# EAGLE design module_duino (EAGLE 7.1.0)
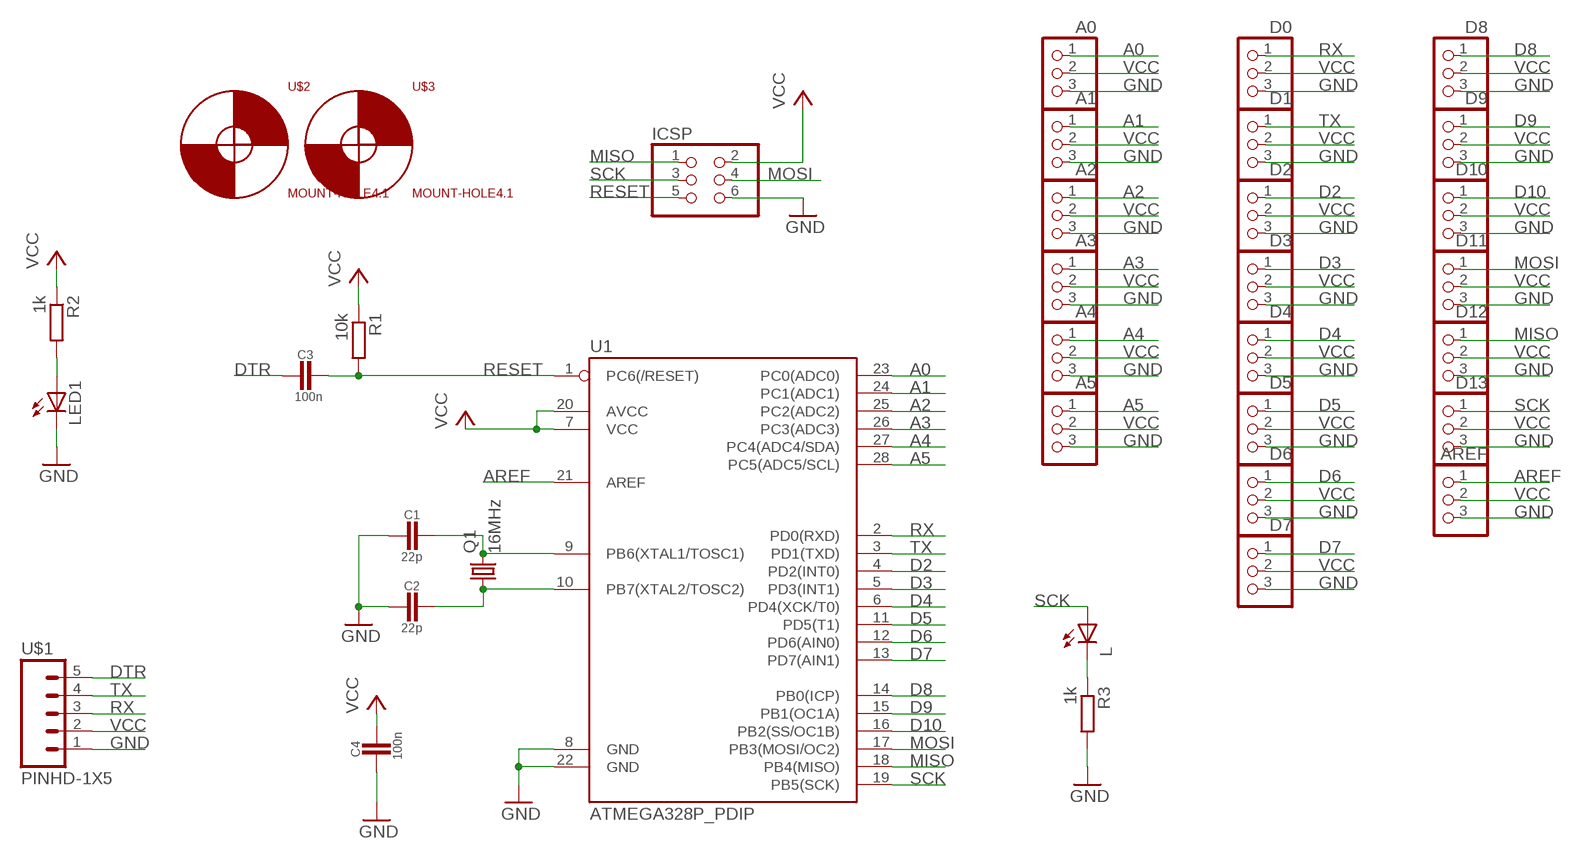
[diagram p0: schematic, sheet 1]

## Parts
A0  PINHD-1X3  [1X03]
A1  PINHD-1X3  [1X03]
A2  PINHD-1X3  [1X03]
A3  PINHD-1X3  [1X03]
A4  PINHD-1X3  [1X03]
A5  PINHD-1X3  [1X03]
AREF  PINHD-1X3  [1X03]
C1  22p  CAP  [CAP-PTH-5MM]
C2  22p  CAP  [CAP-PTH-5MM]
C3  100n  CAP  [CAP-PTH-5MM]
C4  100n  CAP  [CAP-PTH-5MM]
D0  PINHD-1X3  [1X03]
D1  PINHD-1X3  [1X03]
D2  PINHD-1X3  [1X03]
D3  PINHD-1X3  [1X03]
D4  PINHD-1X3  [1X03]
D5  PINHD-1X3  [1X03]
D6  PINHD-1X3  [1X03]
D7  PINHD-1X3  [1X03]
D8  PINHD-1X3  [1X03]
D9  PINHD-1X3  [1X03]
D10  PINHD-1X3  [1X03]
D11  PINHD-1X3  [1X03]
D12  PINHD-1X3  [1X03]
D13  PINHD-1X3  [1X03]
ICSP  PINHD-2X3  [2X03]
L  LED5MM  [LED5MM]
LED1  LED5MM  [LED5MM]
Q1  16MHz  CRYSTAL  [HC49/S]
R1  10k  R-EU_0207_7  [0207/7]
R2  1k  R-EU_0207_7  [0207/7]
R3  1k  R-EU_0207_7  [0207/7]
U1  ATMEGA328P_PDIP  [DIL28-3]
U$1  PINHD-1X5  [1X05-CLEAN]
U$2  MOUNT-HOLE4.1  [4.1]
U$3  MOUNT-HOLE4.1  [4.1]

## Nets
A0: A0.1 U1.23(PC0(ADC0))
A1: A1.1 U1.24(PC1(ADC1))
A2: A2.1 U1.25(PC2(ADC2))
A3: A3.1 U1.26(PC3(ADC3))
A4: A4.1 U1.27(PC4(ADC4/SDA))
A5: A5.1 U1.28(PC5(ADC5/SCL))
AREF: AREF.1 U1.21(AREF)
D2: D2.1 U1.4(PD2(INT0))
D3: D3.1 U1.5(PD3(INT1))
D4: D4.1 U1.6(PD4(XCK/T0))
D5: D5.1 U1.11(PD5(T1))
D6: D6.1 U1.12(PD6(AIN0))
D7: D7.1 U1.13(PD7(AIN1))
D8: D8.1 U1.14(PB0(ICP))
D9: D9.1 U1.15(PB1(OC1A))
D10: D10.1 U1.16(PB2(SS/OC1B))
DTR: C3.1 U$1.5
GND: A0.3 A1.3 A2.3 A3.3 A4.3 A5.3 AREF.3 C1.1 C2.1 C4.1 D0.3 D1.3 D2.3 D3.3 D4.3 D5.3 D6.3 D7.3 D8.3 D9.3 D10.3 D11.3 D12.3 D13.3 ICSP.6 LED1.K(C) R3.2 U1.8(GND) U1.22(GND) U$1.1
MISO: D12.1 ICSP.1 U1.18(PB4(MISO))
MOSI: D11.1 ICSP.4 U1.17(PB3(MOSI/OC2))
N$1: LED1.A R2.2
N$2: C1.2 Q1.2 U1.9(PB6(XTAL1/TOSC1))
N$3: C2.2 Q1.1 U1.10(PB7(XTAL2/TOSC2))
N$4: L.K(C) R3.1
RESET: C3.2 ICSP.5 R1.2 U1.1(PC6(/RESET))
RX: D0.1 U1.2(PD0(RXD)) U$1.3
SCK: D13.1 ICSP.3 L.A U1.19(PB5(SCK))
TX: D1.1 U1.3(PD1(TXD)) U$1.4
VCC: A0.2 A1.2 A2.2 A3.2 A4.2 A5.2 AREF.2 C4.2 D0.2 D1.2 D2.2 D3.2 D4.2 D5.2 D6.2 D7.2 D8.2 D9.2 D10.2 D11.2 D12.2 D13.2 ICSP.2 R1.1 R2.1 U1.7(VCC) U1.20(AVCC) U$1.2

## Library data of the parts
A0 A1-A5 AREF D0 D1-D13 = robocraft:PINHD-1X3: PIN HEADER
C1-C4 = robocraft:CAP: capacitor
ICSP = robocraft:PINHD-2X3: PIN HEADER
L LED1 = led:LED: LED OSRAM: - CHIPLED LG R971, LG N971, LY N971, LG Q971, LY Q971, LO R971, LY R971 LH N974, LH R974 LS Q976, LO Q976, LY Q976 LO Q996 - Hyper CHIPLED LW Q18S LB Q993, LB Q99A, LB R99A - SideLED LS A670, LO A670, LY A670, LG A670, LP A670 LB A673, LV A673, LT A673, LW A673 LH A674 LY A675 LS A676, LA A676, LO A676, LY A676, LW A676 LS A679, LY A679, LG A679 - Hyper Micro SIDELED® LS Y876, LA Y876, LO Y876, LY Y876 LT Y87S - SmartLED LW L88C, LW L88S LB L89C, LB L89S, LG L890 LS L89K, LO L89K, LY L89K LS L896, LA L896, LO L896, LY L896 - TOPLED LS T670, LO T670, LY T670, LG T670, LP T670 LSG T670, LSP T670, LSY T670, LOP T670, LYG T670 LG T671, LOG T671, LSG T671 LB T673, LV T673, LT T673, LW T673 LH T674 LS T676, LA T676, LO T676, LY T676, LB T676, LH T676, LSB T676, LW T676 LB T67C, LV T67C, LT T67C, LS T67K, LO T67K, LY T67K, LW E67C LS E67B, LA E67B, LO E67B, LY E67B, LB E67C, LV E67C, LT E67C LW T67C LS T679, LY T679, LG T679 LS T770, LO T770, LY T770, LG T770, LP T770 LB T773, LV T773, LT T773, LW T773 LH T774 LS E675, LA E675, LY E675, LS T675 LS T776, LA T776, LO T776, LY T776, LB T776 LHGB T686 LT T68C, LB T68C - Hyper Mini TOPLED® LB M676 - Mini TOPLED Santana® LG M470 LS M47K, LO M47K, LY M47K Source: http://www.osram.convergy.de LUXEON: - LUMILED® LXK2-PW12-R00, LXK2-PW12-S00, LXK2-PW14-U00, LXK2-PW14-V00 LXK2-PM12-R00, LXK2-PM12-S00, LXK2-PM14-U00 LXK2-PE12-Q00, LXK2-PE12-R00, LXK2-PE12-S00, LXK2-PE14-T00, LXK2-PE14-U00 LXK2-PB12-K00, LXK2-PB12-L00, LXK2-PB12-M00, LXK2-PB14-N00, LXK2-PB14-P00, LXK2-PB14-Q00 LXK2-PR12-L00, LXK2-PR12-M00, LXK2-PR14-Q00, LXK2-PR14-R00 LXK2-PD12-Q00, LXK2-PD12-R00, LXK2-PD12-S00 LXK2-PH12-R00, LXK2-PH12-S00 LXK2-PL12-P00, LXK2-PL12-Q00, LXK2-PL12-R00 Source: www.luxeon.com KINGBRIGHT: KA-3528ASYC Source: www.kingbright.com
Q1 = robocraft:CRYSTAL: CRYSTAL
R1-R3 = resistor:R-EU_: RESISTOR, European symbol; SPICEPREFIX: R
U1 = robocraft:ATMEGA328P_PDIP: uC used in the Arduino 32kb flash, 1k EEPROM, 2k SRAM This is the through-hole version of this chip.
U$1 = robocraft:PINHD-1X5
U$2 U$3 = robocraft:MOUNT-HOLE: Mount hole

## Board
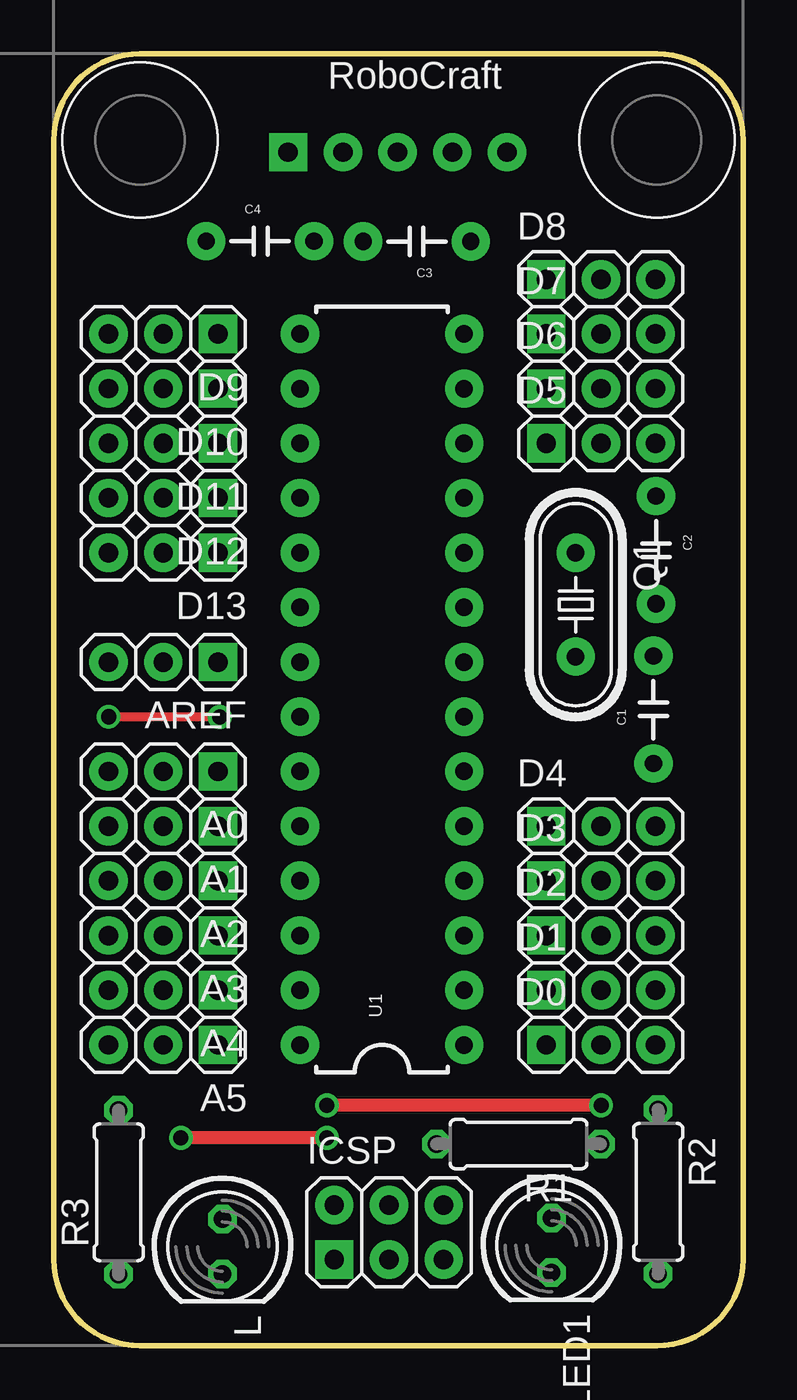
[diagram p1: board, top side]
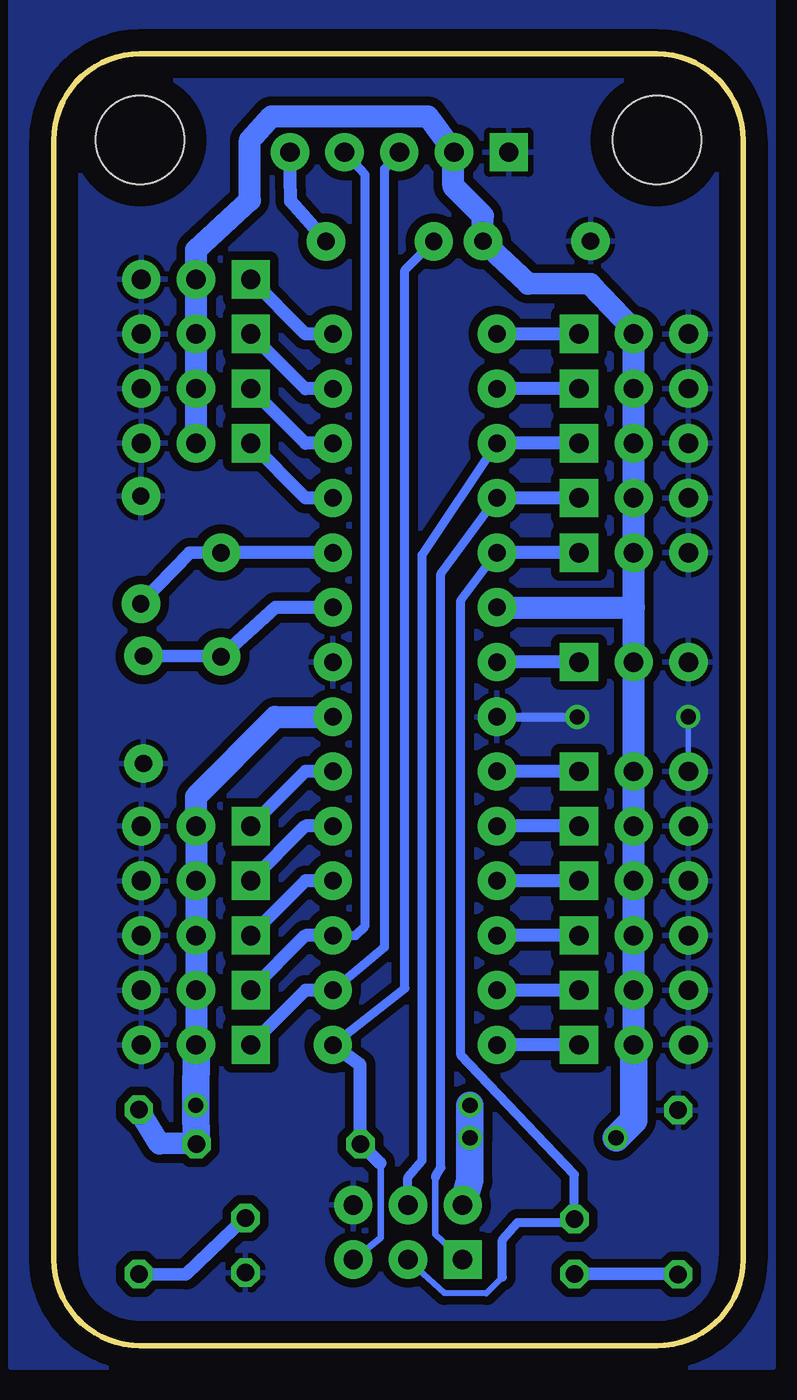
[diagram p2: board, bottom side, seen from below]

Size 32 x 60 mm. Coordinates in mm from the lower left corner, seen from the top.
Outline: 4,0 28,0 arc90 32,4 32,56 arc90 28,60 4,60 arc90 0,56 0,4 arc90 4,0
Copper layers (1*16): Top 0.035mm / dielectric 1.5mm / Bottom 0.035mm
Design rules "default": minimum track width 10mil, minimum drill 24mil, track to track 8mil, track to pad 8mil, pad to pad 8mil, via to via 8mil, smd to smd 8mil, copper to edge 40mil, drill to drill 8mil, minimum pad ring 10mil, minimum via ring 8mil, stop-mask expansion 4mil, vias tented up to drill 0mil, thermal gap 10mil

### Footprints (pad centres in the part's own frame; a part is rotated, then mirrored left to right if it is on the bottom)
1X03 = drill 0.9 pad 1.778 square: 1 -2.54,0 | drill 0.9 pad 1.778: 2 0,0; 3 2.54,0
CAP-PTH-5MM = drill 0.8 pad 1.778: 1 0,0; 2 5,0
2X03 = drill 0.9 pad 1.778 square: 1 -2.54,-1.27 | drill 0.9 pad 1.778: 2 -2.54,1.27; 3 0,-1.27; 4 0,1.27; 5 2.54,-1.27; 6 2.54,1.27
LED5MM = drill 0.813 octagon: A -1.27,0; K 1.27,0
HC49/S = drill 0.813 pad 1.778: 1 -2.413,0; 2 2.413,0
0207/7 = drill 0.813 octagon: 1 -3.81,0; 2 3.81,0
DIL28-3 = drill 0.813 pad 1.778: 1 -16.51,-3.81; 2 -13.97,-3.81; 3 -11.43,-3.81; 4 -8.89,-3.81; 5 -6.35,-3.81; 6 -3.81,-3.81; 7 -1.27,-3.81; 8 1.27,-3.81; 9 3.81,-3.81; 10 6.35,-3.81; 11 8.89,-3.81; 12 11.43,-3.81; 13 13.97,-3.81; 14 16.51,-3.81; 15 16.51,3.81; 16 13.97,3.81; 17 11.43,3.81; 18 8.89,3.81; 19 6.35,3.81; 20 3.81,3.81; 21 1.27,3.81; 22 -1.27,3.81; 23 -3.81,3.81; 24 -6.35,3.81; 25 -8.89,3.81; 26 -11.43,3.81; 27 -13.97,3.81; 28 -16.51,3.81
1X05-CLEAN = drill 0.9 pad 1.778 square: 1 0,0 | drill 0.9 pad 1.778: 2 2.54,0; 3 5.08,0; 4 7.62,0; 5 10.16,0
4.1 = hole 4.1: 0,0

### Placement (x,y rotation side)
A0  5.08,26.67 180 top
A1  5.08,24.13 180 top
A2  5.08,21.59 180 top
A3  5.08,19.05 180 top
A4  5.08,16.51 180 top
A5  5.08,13.97 180 top
AREF  5.08,31.75 180 top
C1  27.84,27.04 90 top
C2  27.96,39.46 270 top
C3  19.36,51.29 180 top
C4  7.08,51.3 0 top
D0  25.4,13.97 0 top
D1  25.4,16.51 0 top
D2  25.4,19.05 0 top
D3  25.4,21.59 0 top
D4  25.4,24.13 0 top
D5  25.4,41.91 0 top
D6  25.4,44.45 0 top
D7  25.4,46.99 0 top
D8  25.4,49.53 0 top
D9  5.08,46.99 180 top
D10  5.08,44.45 180 top
D11  5.08,41.91 180 top
D12  5.08,39.37 180 top
D13  5.08,36.83 180 top
ICSP  15.56,5.27 0 top
L  7.83,4.6 270 top
LED1  23.11,4.66 270 top
Q1  24.23,34.42 270 top
R1  21.58,9.36 180 top
R2  28.06,7.14 270 top
R3  3.01,7.12 90 top
U1  15.24,30.48 90 top
U$1  10.88,55.43 0 top
U$2  4,56 0 top
U$3  28,56 0 top

### Tracks (layer width: path | path; a pad name or v marks a point on that pad's centre or on a via)
A0
  Bottom 0.61: A0.1 U1.23
A1
  Bottom 0.61: A1.1 U1.24
A2
  Bottom 0.61: A2.1 U1.25
A3
  Bottom 0.61: A3.1 U1.26
A4
  Bottom 0.61: A4.1 U1.27
A5
  Bottom 0.61: A5.1 U1.28
AREF
  Bottom 0.61: AREF.1 U1.21
D2
  Bottom 0.61: U1.4 20.32,21.59 D2.1
D3
  Bottom 0.61: U1.5 20.32,24.13 D3.1
D4
  Bottom 0.61: U1.6 20.32,26.67 D4.1
D5
  Bottom 0.61: U1.11 20.32,39.37 D5.1
D6
  Bottom 0.61: U1.12 20.32,41.91 D6.1
D7
  Bottom 0.61: U1.13 20.32,44.45 D7.1
D8
  Bottom 0.61: U1.14 20.32,46.99 D8.1
D9
  Bottom 0.61: D9.1 U1.15
D10
  Bottom 0.61: D10.1 U1.16
DTR
  Bottom 0.61: C3.1 21.01,53.15 U$1.5
GND  (via drill 0.7)
  Top 0.406: v7.7,29.2 v2.54,29.21
  Bottom 0.254: v2.54,29.21 A0.3
  Bottom 0.406: U1.22 v7.71,29.21 v7.7,29.2
  pour Bottom (isolate 0.406): -1.4,70 34,70 34,-1 -1.4,-1
MISO
  Bottom 0.305: 14.29,7.84 14.29,7.1 14.29,5.17 ICSP.1
  Bottom 0.406: U1.18 14.03,35.84 14.03,8.28 14.29,7.84
  Bottom 0.61: D12.1 U1.18
MOSI
  Bottom 0.406: U1.17 14.9,36.74 14.9,8.6 15.56,7.82 ICSP.4
  Bottom 0.61: D11.1 U1.17
N$1
  Bottom 0.61: R2.2 25.85,3.32 LED1.A
N$2
  Bottom 0.61: U1.9 21.72,34.29 Q1.2 C1.2
N$3
  Bottom 0.61: U1.10 24,36.83 Q1.1 25.7,36.83 C2.2
N$4
  Bottom 0.61: R3.1 L.K
RESET
  Bottom 0.305: ICSP.5 16.83,5.02 16.83,8.45 16.86,8.48
  Bottom 0.406: U1.1 15.7,16.6 15.7,49.95 C3.2
  Bottom 0.61: U1.1 17.78,13.05 R1.2 16.86,8.48
RX
  Bottom 0.406: U1.2 16.64,18.51 16.64,54.65 U$1.3
  Bottom 0.61: U1.2 20.32,16.51 D0.1
SCK
  Bottom 0.305: ICSP.3 13.87,2.45 11.91,2.44 11.18,3.18 | 7.67,5.73 L.A
  Bottom 0.406: U1.19 13.1,34.61 13.1,13.5 7.83,7.95 L.A | 11.18,3.18 11.18,4.91 10.47,5.73 7.67,5.73
  Bottom 0.61: D13.1 U1.19
TX
  Bottom 0.406: U1.3 18,19.05 17.55,19.5 17.55,54.38 U$1.4
  Bottom 0.61: U1.3 20.32,19.05 D1.1
VCC  (via drill 0.7)
  Top 0.61: v12.68,9.65 v5.9,9.65 | v25.41,11.16 v12.68,11.15
  Bottom 1.016: D0.2 D1.2 D2.2 D3.2 D4.2 25.4,25.51 21.72,29.2 U1.7 | A5.2 A4.2 A3.2 A2.2 A1.2 A0.2 AREF.2 D13.2 | D13.2 D12.2 D11.2 D10.2 D9.2 5.08,47.18 7.09,49.31 9.98,49.32 C4.2 12.08,52.48 13.45,53.85 13.45,55.4 U$1.2 14.64,57.1 21.9,57.1 22.9,56 22.9,53.2 25.4,50.9 D8.2 D7.2 D6.2 D5.2 | U1.20 5.07,34.29 D13.2 | R1.1 27.1,9.39 R2.1
  Bottom 1.27: D0.2 v25.41,11.16 R1.1 | v5.9,9.65 5.08,10.47 A5.2 | v12.68,11.15 v12.68,9.65 12.69,7.67 ICSP.2

### Text on the board
tPlace: RoboCraft